# Altium project button_ban_dao.PrjPcb
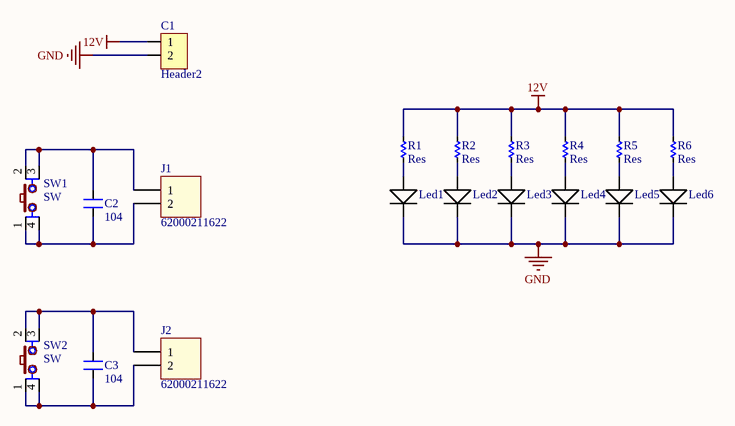
[diagram p0: button_ban_dao_schematic.SchDoc]
1 sheet, 19 parts. Net scope: global (net labels, ports and power ports of the same name join across sheets).
Board file: button_ban_dao_pcb.PcbDoc

## Sheet button_ban_dao_schematic.SchDoc
size A

### Parts
C1  Header2  [Header2]
C2  104  [SM-CAP-0805]
C3  104  [SM-CAP-0805]
J1  62000211622  [62000211622]
J2  62000211622  [62000211622]
Led1  LED5730  [LED5730]  (value not drawn)
Led2  LED5730  [LED5730]  (value not drawn)
Led3  LED5730  [LED5730]  (value not drawn)
Led4  LED5730  [LED5730]  (value not drawn)
Led5  LED5730  [LED5730]  (value not drawn)
Led6  LED5730  [LED5730]  (value not drawn)
R1  Res  [RES-SMD-0805]
R2  Res  [RES-SMD-0805]
R3  Res  [RES-SMD-0805]
R4  Res  [RES-SMD-0805]
R5  Res  [RES-SMD-0805]
R6  Res  [RES-SMD-0805]
SW1  SW  [SW2-SMD]
SW2  SW  [SW2-SMD]

### Nets
12V: C1.1 R1.1 R2.1 R3.1 R4.1 R5.1 R6.1
GND: C1.2 Led1.1 Led2.1 Led3.1 Led4.1 Led5.1 Led6.1
NetC2_1: C2.1 J1.2 SW1.1 SW1.4
NetC2_2: C2.2 J1.1 SW1.2 SW1.3
NetC3_1: C3.1 J2.2 SW2.1 SW2.4
NetC3_2: C3.2 J2.1 SW2.2 SW2.3
NetLed1_0: Led1.0 R1.2
NetLed2_0: Led2.0 R2.2
NetLed3_0: Led3.0 R3.2
NetLed4_0: Led4.0 R4.2
NetLed5_0: Led5.0 R5.2
NetLed6_0: Led6.0 R6.2

### Library data of the parts
C1 = Header2: Header IDC, 2 x 1 Pin Vertical 2.54mm Pitch (Non-Boxed, Male); Manufacturer: W¨¹rth Elektronik eiSos GmbH; partNo: 613002143121; ComponentLink1 Description: Manufacturer; ComponentLink2 Description: Datasheet; NoPins: 02; Created Date: 29 March 2013; ComponentLink1URL: http://www.we-online.com; ComponentLink2URL: http://katalog.we-online.de/em/datasheet/6130xx143121.pdf; Created by: Karrer Zheng
C2 C3 = CN: Value: 0,1uF/300V; Designed by: VanDungEvn
J1 J2 = 62000211622: WR-WTB 2.00mm Male Vertical Shrouded Header, 2p; Pin Number: 2; ComponentLink1Description: Manufacturer; ComponentLink1URL: http://www.we-online.de; ComponentLink2Description: Datasheet; ComponentLink2URL: http://katalog.we-online.de/em/datasheet/6200xx11622.pdf; Part Number: 62000211622; Published Date: June 2017; Publisher: Wurth Elektronik; Pitch: 2.00 mm
R1-R6 = Res-SMD: Resistor; Manufacturer: Generic Components; Class: Passive; Published: 08/06/2000; Publisher: Altium Hobart Technology Centre
SW1 SW2 = SW4: Switch button 4 pin; Value: Button chip 4 pin